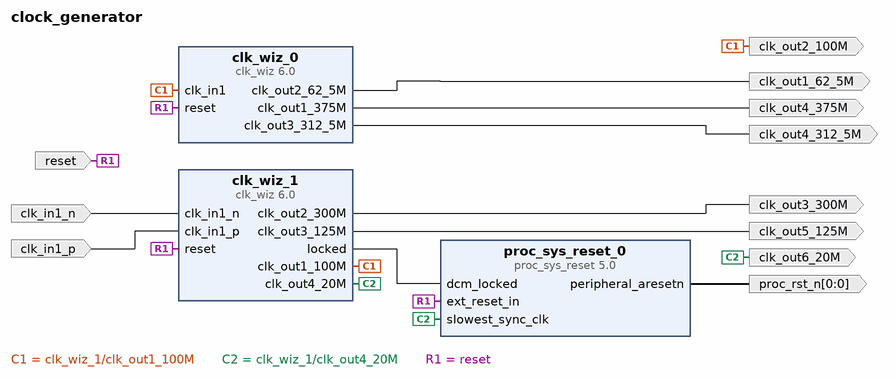
[diagram p0: block diagram of the top level]
# Vivado block design clock_generator, xcku5p-ffvb676-2-e, Vivado 2022.1
create_bd_design clock_generator

create_bd_port -dir I -type clk clk_in1_n
set_property -dict {CONFIG.FREQ_HZ 300000000} [get_bd_ports clk_in1_n]
create_bd_port -dir I -type clk clk_in1_p
set_property -dict {CONFIG.FREQ_HZ 300000000} [get_bd_ports clk_in1_p]
create_bd_port -dir I -type rst reset
set_property -dict {CONFIG.POLARITY ACTIVE_HIGH} [get_bd_ports reset]
create_bd_port -dir O -type clk clk_out2_100M
create_bd_port -dir O -type clk clk_out3_300M
create_bd_port -dir O -type clk clk_out1_62_5M
create_bd_port -dir O -type clk clk_out4_375M
create_bd_port -dir O -type clk clk_out5_125M
create_bd_port -dir O -from 0 -to 0 proc_rst_n
create_bd_port -dir O clk_out6_20M
create_bd_port -dir O -type clk clk_out4_312_5M
set_property -dict {CONFIG.FREQ_HZ 312500000} [get_bd_ports clk_out4_312_5M]

create_bd_cell -type ip -vlnv xilinx.com:ip:clk_wiz:6.0 clk_wiz_0
set_property -dict [list \
  CONFIG.CLKOUT1_DRIVES Buffer \
  CONFIG.CLKOUT1_JITTER 104.411 \
  CONFIG.CLKOUT1_PHASE_ERROR 102.245 \
  CONFIG.CLKOUT1_REQUESTED_OUT_FREQ 375 \
  CONFIG.CLKOUT2_DRIVES Buffer \
  CONFIG.CLKOUT2_JITTER 147.574 \
  CONFIG.CLKOUT2_PHASE_ERROR 102.245 \
  CONFIG.CLKOUT2_REQUESTED_OUT_FREQ 62.5 \
  CONFIG.CLKOUT2_USED true \
  CONFIG.CLKOUT3_DRIVES Buffer \
  CONFIG.CLKOUT3_JITTER 107.975 \
  CONFIG.CLKOUT3_PHASE_ERROR 102.245 \
  CONFIG.CLKOUT3_REQUESTED_OUT_FREQ 312.500 \
  CONFIG.CLKOUT3_USED true \
  CONFIG.CLKOUT4_DRIVES Buffer \
  CONFIG.CLKOUT5_DRIVES Buffer \
  CONFIG.CLKOUT6_DRIVES Buffer \
  CONFIG.CLKOUT7_DRIVES Buffer \
  CONFIG.CLK_OUT1_PORT clk_out1_375M \
  CONFIG.CLK_OUT2_PORT clk_out2_62_5M \
  CONFIG.CLK_OUT3_PORT clk_out3_312_5M \
  CONFIG.FEEDBACK_SOURCE FDBK_AUTO \
  CONFIG.MMCM_CLKFBOUT_MULT_F 9.375 \
  CONFIG.MMCM_CLKOUT0_DIVIDE_F 2.500 \
  CONFIG.MMCM_CLKOUT1_DIVIDE 15 \
  CONFIG.MMCM_CLKOUT2_DIVIDE 3 \
  CONFIG.MMCM_DIVCLK_DIVIDE 1 \
  CONFIG.NUM_OUT_CLKS 3 \
  CONFIG.OPTIMIZE_CLOCKING_STRUCTURE_EN false \
  CONFIG.SECONDARY_SOURCE Single_ended_clock_capable_pin \
  CONFIG.USE_PHASE_ALIGNMENT false \
] [get_bd_cells clk_wiz_0]
create_bd_cell -type ip -vlnv xilinx.com:ip:clk_wiz:6.0 clk_wiz_1
set_property -dict [list \
  CONFIG.CLKIN1_JITTER_PS 33.330000000000005 \
  CONFIG.CLKOUT1_DRIVES Buffer \
  CONFIG.CLKOUT1_JITTER 95.138 \
  CONFIG.CLKOUT1_PHASE_ERROR 71.599 \
  CONFIG.CLKOUT1_REQUESTED_OUT_FREQ 100.000 \
  CONFIG.CLKOUT2_DRIVES Buffer \
  CONFIG.CLKOUT2_JITTER 76.789 \
  CONFIG.CLKOUT2_PHASE_ERROR 71.599 \
  CONFIG.CLKOUT2_REQUESTED_OUT_FREQ 300 \
  CONFIG.CLKOUT2_USED true \
  CONFIG.CLKOUT3_DRIVES Buffer \
  CONFIG.CLKOUT3_JITTER 91.083 \
  CONFIG.CLKOUT3_PHASE_ERROR 71.599 \
  CONFIG.CLKOUT3_REQUESTED_OUT_FREQ 125.000 \
  CONFIG.CLKOUT3_USED true \
  CONFIG.CLKOUT4_DRIVES Buffer \
  CONFIG.CLKOUT4_JITTER 130.583 \
  CONFIG.CLKOUT4_PHASE_ERROR 71.599 \
  CONFIG.CLKOUT4_REQUESTED_OUT_FREQ 20.000 \
  CONFIG.CLKOUT4_USED true \
  CONFIG.CLKOUT5_DRIVES Buffer \
  CONFIG.CLKOUT5_JITTER 100.635 \
  CONFIG.CLKOUT5_PHASE_ERROR 71.599 \
  CONFIG.CLKOUT5_REQUESTED_OUT_FREQ 75 \
  CONFIG.CLKOUT5_USED false \
  CONFIG.CLKOUT6_DRIVES Buffer \
  CONFIG.CLKOUT7_DRIVES Buffer \
  CONFIG.CLK_OUT1_PORT clk_out1_100M \
  CONFIG.CLK_OUT2_PORT clk_out2_300M \
  CONFIG.CLK_OUT3_PORT clk_out3_125M \
  CONFIG.CLK_OUT4_PORT clk_out4_20M \
  CONFIG.CLK_OUT5_PORT clk_out5_75M \
  CONFIG.FEEDBACK_SOURCE FDBK_AUTO \
  CONFIG.JITTER_SEL No_Jitter \
  CONFIG.MMCM_BANDWIDTH OPTIMIZED \
  CONFIG.MMCM_CLKFBOUT_MULT_F 5.000 \
  CONFIG.MMCM_CLKIN1_PERIOD 3.333 \
  CONFIG.MMCM_CLKIN2_PERIOD 10.0 \
  CONFIG.MMCM_CLKOUT0_DIVIDE_F 15.000 \
  CONFIG.MMCM_CLKOUT0_DUTY_CYCLE 0.500 \
  CONFIG.MMCM_CLKOUT1_DIVIDE 5 \
  CONFIG.MMCM_CLKOUT1_DUTY_CYCLE 0.500 \
  CONFIG.MMCM_CLKOUT2_DIVIDE 12 \
  CONFIG.MMCM_CLKOUT3_DIVIDE 75 \
  CONFIG.MMCM_CLKOUT4_DIVIDE 1 \
  CONFIG.NUM_OUT_CLKS 4 \
  CONFIG.OPTIMIZE_CLOCKING_STRUCTURE_EN false \
  CONFIG.OVERRIDE_MMCM false \
  CONFIG.PRIM_IN_FREQ 300 \
  CONFIG.PRIM_SOURCE Differential_clock_capable_pin \
  CONFIG.SECONDARY_SOURCE Single_ended_clock_capable_pin \
  CONFIG.USE_DYN_PHASE_SHIFT false \
  CONFIG.USE_MIN_POWER false \
  CONFIG.USE_PHASE_ALIGNMENT false \
  CONFIG.USE_SAFE_CLOCK_STARTUP false \
] [get_bd_cells clk_wiz_1]
create_bd_cell -type ip -vlnv xilinx.com:ip:proc_sys_reset:5.0 proc_sys_reset_0
set_property -dict {CONFIG.RESET_BOARD_INTERFACE reset CONFIG.USE_BOARD_FLOW true} [get_bd_cells proc_sys_reset_0]

# ---- connections ----

connect_bd_net [get_bd_ports clk_in1_n] [get_bd_pins clk_wiz_1/clk_in1_n]
connect_bd_net [get_bd_ports clk_in1_p] [get_bd_pins clk_wiz_1/clk_in1_p]
connect_bd_net [get_bd_pins clk_wiz_0/clk_out1_375M] [get_bd_ports clk_out4_375M]
connect_bd_net [get_bd_pins clk_wiz_0/clk_out2_62_5M] [get_bd_ports clk_out1_62_5M]
connect_bd_net [get_bd_pins clk_wiz_0/clk_out3_312_5M] [get_bd_ports clk_out4_312_5M]
connect_bd_net [get_bd_pins clk_wiz_1/clk_out1_100M] [get_bd_pins clk_wiz_0/clk_in1] [get_bd_ports clk_out2_100M]
connect_bd_net [get_bd_pins clk_wiz_1/clk_out2_300M] [get_bd_ports clk_out3_300M]
connect_bd_net [get_bd_pins clk_wiz_1/clk_out3_125M] [get_bd_ports clk_out5_125M]
connect_bd_net [get_bd_pins clk_wiz_1/clk_out4_20M] [get_bd_ports clk_out6_20M] [get_bd_pins proc_sys_reset_0/slowest_sync_clk]
connect_bd_net [get_bd_pins clk_wiz_1/locked] [get_bd_pins proc_sys_reset_0/dcm_locked]
connect_bd_net [get_bd_pins proc_sys_reset_0/peripheral_aresetn] [get_bd_ports proc_rst_n]
connect_bd_net [get_bd_ports reset] [get_bd_pins clk_wiz_1/reset] [get_bd_pins clk_wiz_0/reset] [get_bd_pins proc_sys_reset_0/ext_reset_in]

validate_bd_design
save_bd_design
